# Altium schematic sheet ZP_Force_Plates.SchDoc
size Tabloid; Organization: Altium Limited; Address1: L3, 12a Rodborough Rd; Address2: Frenchs Forest; Address3: NSW; Address4: Australia 2086
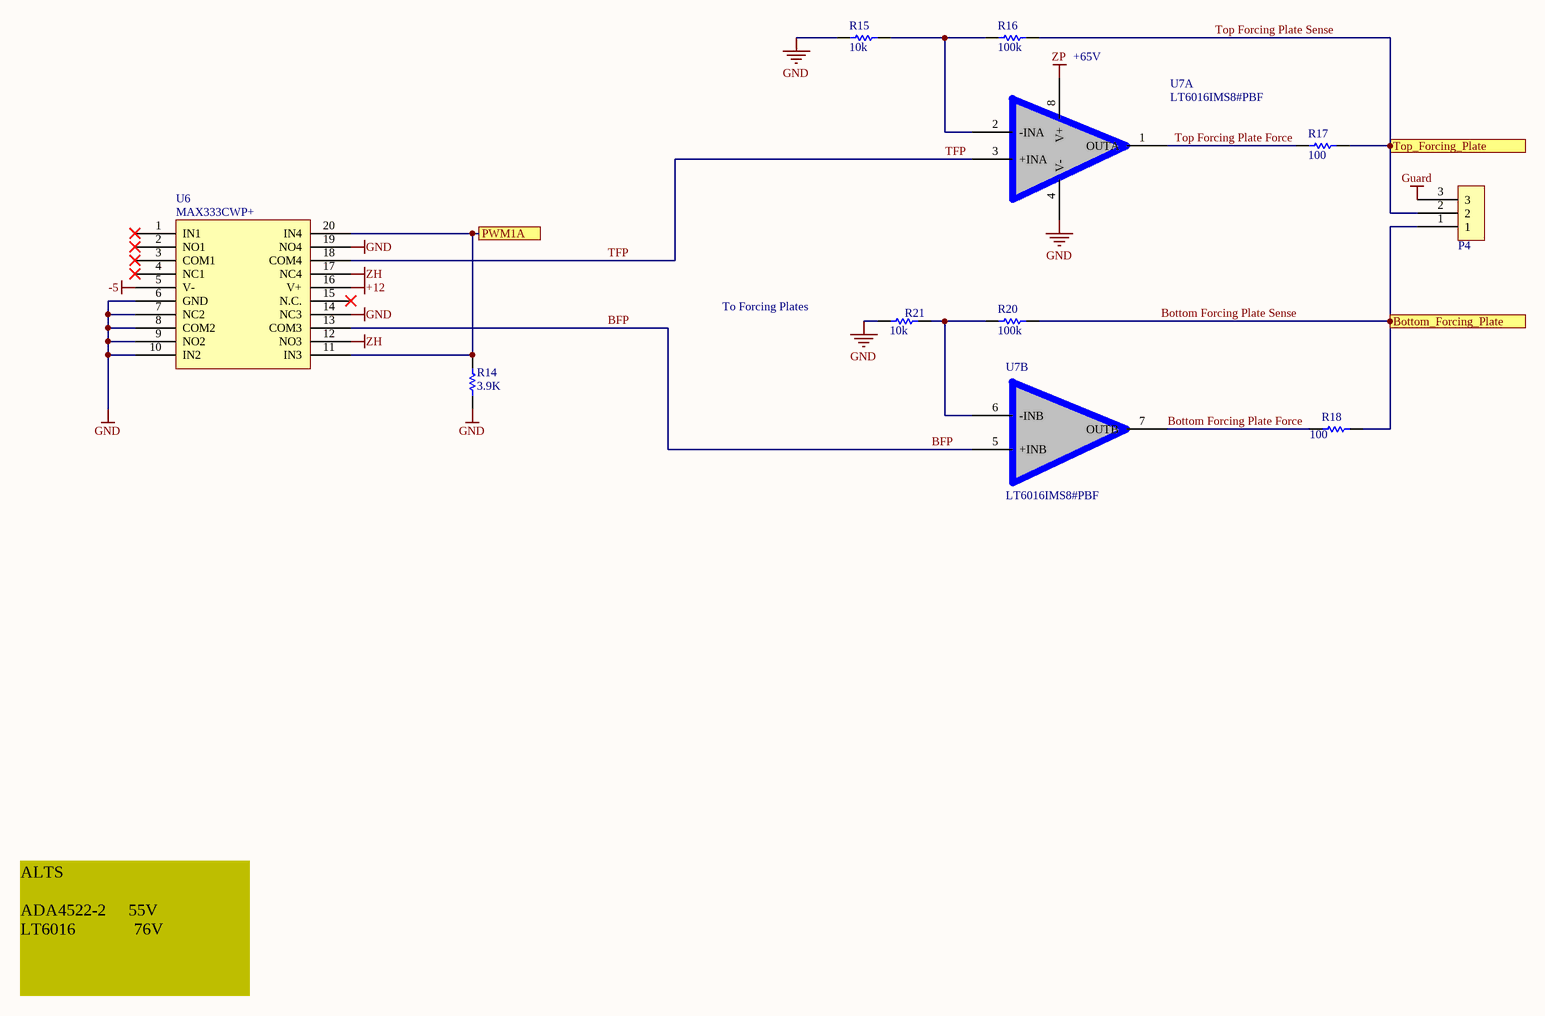
[diagram p0: ZP_Force_Plates.SchDoc]

## Parts
P4  Triax_Conn  [Triax_Conn]  (value not drawn)
R14  3.9K  [RESC0402(1005)_M]
R15  10k  [RESC0402(1005)_M]
R16  100k  [RESC0402(1005)_M]
R17  100  [RESC0402(1005)_M]
R18  100  [RESC0402(1005)_M]
R20  100k  [RESC0402(1005)_M]
R21  10k  [RESC0402(1005)_M]
U6  MAX333CWP+  [TSOP65P640X90-20N]
U7  Supplier Part Number 1: LT6016IMS8#PBF  [LT6016]  (hidden comment: LT6016)  (parts A,B of 2)

## Ports
Bottom_Forcing_Plate, PWM1A, Top_Forcing_Plate

## Nets
+12: U6.16(V+)
-5: U6.5(V-)
GND: R14.1 R15.1 R21.1 U6.6(GND) U6.7(NC2) U6.8(COM2) U6.9(NO2) U6.10(IN2) U6.14(NC3) U6.19(NO4) U7.4(V-)
Guard: P4.3
ZH: U6.12(NO3) U6.17(NC4)
ZP: U7.8(V+)
BFP: U6.13(COM3) U7.5(+INB)
Bottom Forcing Plate Force: R18.1 U7.7(OUTB)
Bottom Forcing Plate Sense: P4.1 R18.2 R20.2 ; port Bottom_Forcing_Plate
PWM1A: R14.2 U6.11(IN3) U6.20(IN4) ; port PWM1A
TFP: U6.18(COM4) U7.3(+INA)
Top Forcing Plate Force: R17.1 U7.1(OUTA)
Top Forcing Plate Sense: P4.2 R16.2 R17.2 ; port Top_Forcing_Plate
NetR15_2: R15.2 R16.1 U7.2(-INA)
NetR20_1: R20.1 R21.2 U7.6(-INB)

Not connected (* = marked no-connect by the designer): U6 1(IN1)* 2(NO1)* 3(COM1)* 4(NC1)* 15(N.C.)*

## Notes on the sheet
- +65V
- To Forcing Plates
- ALTS
  ADA4522-2     55V
  LT6016             76V
- Title
- Size:
- Date:
- Tabloid
- Number:
- Time:
- Revision:
- Sheet
- of
- ZLS Corporation
- 7801 North Lamar Blvd.
- Suite E-184
- Austin, Texas 78752  USA
- (512) 453-0288
- File:

## Library data of the parts
R14-R18 R20 R21 = CMP-1011-00463-1
U6 = MAX333CWP+: IC SWITCH QUAD SPDT 20TSSOP; Manufacturer: Maxim; Manufacturer Part Number: MAX333AEUP+; Max Supply Voltage: 30V; Min Supply Voltage: 10V; Min Dual Supply Voltage: 4.5V; Max Dual Supply Voltage: 20V; On-State Resistance: 35R; Operating Supply Current: 1uA; Supply Type: Single,Dual; Max Power Dissipation: 559mW; Turn-On Delay Time: 175ns; Turn-Off Delay Time: 145ns; Max Supply Current: 250uA; Number of Bits: 4; Dual Supply Voltage: 15V; Supplier 1: Mouser; Supplier Part Number 1: 700-MAX333AEUP; Stock 1: 664; Pricing 1: 1=6.77, 10=6.43, 50=5.8, 100=5.8, 1000=5.62, 10000=5.62 (USD); Case/Package: TSSOP; Number of Pins: 20; Weight: 0.006737oz; Min Operating Temperature: -40°C; Max Operating Temperature: 85°C; Packaging: Rail/Tube; Package Quantity: 74; Throw Configuration: SPDT; Number of Channels: 4; Length: 6.6mm; Height: 0.95mm; Width: 4.5mm; Radiation Hardening: No; Lead Free: Lead Free; REACH SVHC: Unknown; ComponentLink1URL: https://datasheet.ciiva.com/2978/max333a-2978850.pdf; ComponentLink1Description: https://datasheet.ciiva.com/2978/max333a-2978850.pdf; ComponentLink2URL: https://datasheet.ciiva.com/30478/0900766b81253c85-30478260.pdf; ComponentLink2Description: https://datasheet.ciiva.com/30478/0900766b81253c85-30478260.pdf; ComponentLink3URL: https://datasheet.ciiva.com/1674/max333a-1674617.pdf; ComponentLink3Description: https://datasheet.ciiva.com/1674/max333a-1674617.pdf; ComponentLink4URL: https://datasheet.ciiva.com/26825/max333aeup-26825546.pdf; ComponentLink4Description: https://datasheet.ciiva.com/26825/max333aeup-26825546.pdf
U7 = LT6016: IC OPAMP GP 3.3MHZ RRO 8MSOP; Supplier 1: Arrow